# Altium project Car.PrjPcb
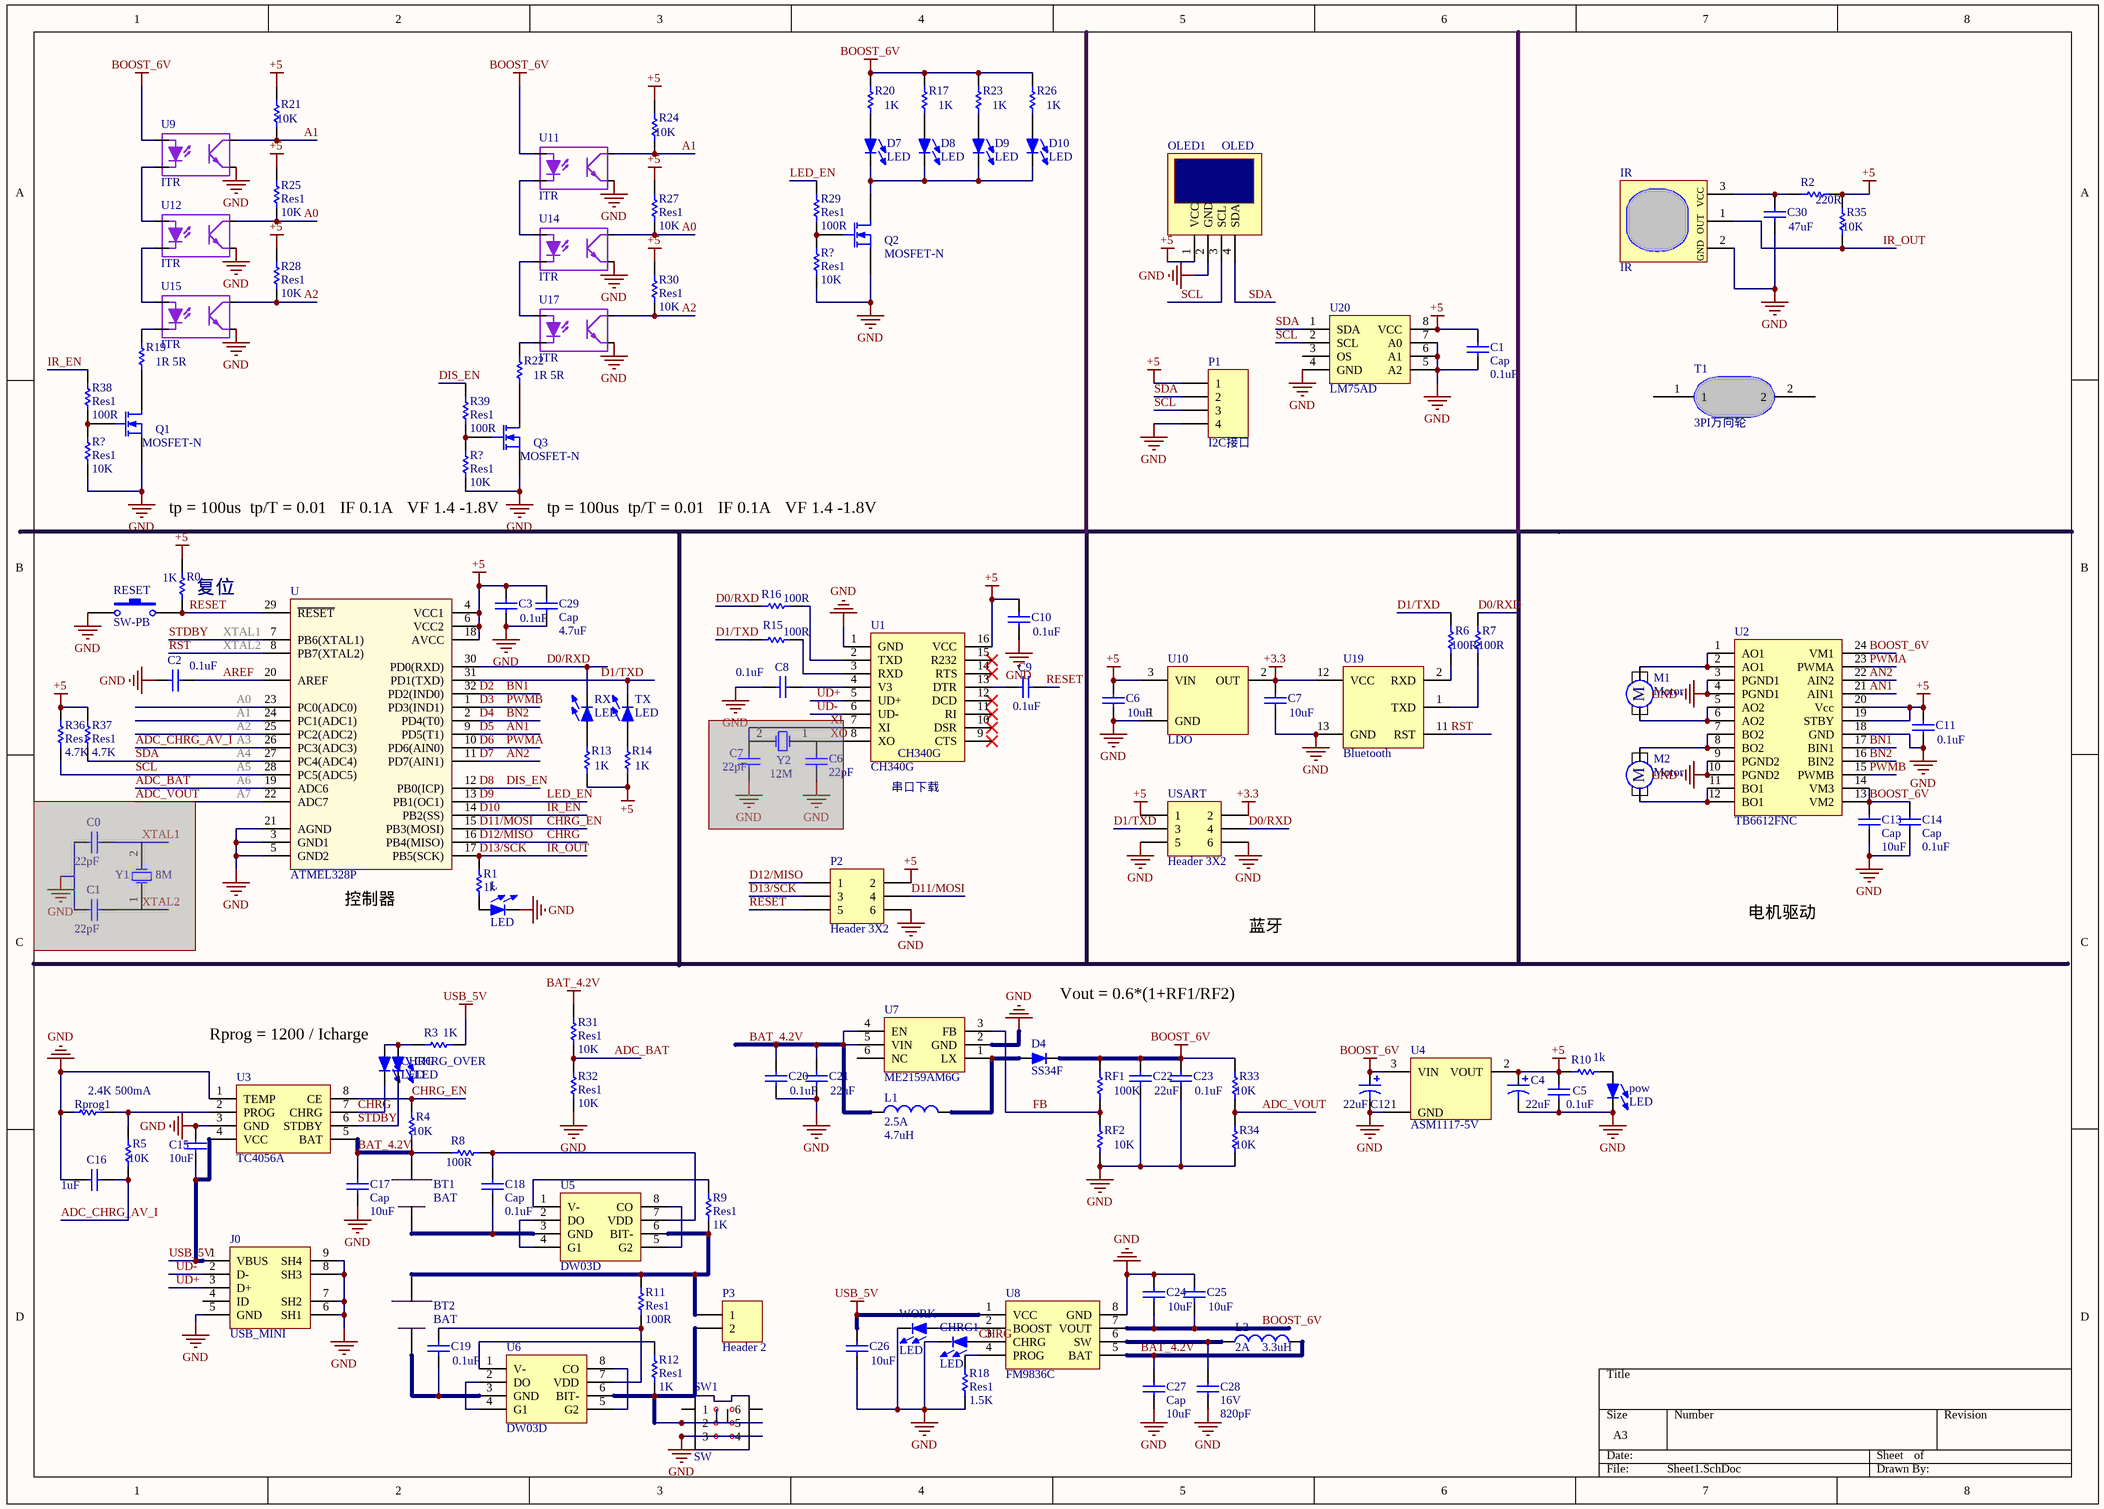
[diagram p0: Sheet1.SchDoc]
1 sheet, 132 parts. Net scope: global (net labels, ports and power ports of the same name join across sheets).
Board file: PCB1.PcbDoc

## Sheet Sheet1.SchDoc
size A3

### Parts
(Parts that share a designator on the sheet are numbered #1, #2 ... from top to bottom, then left to right.)
BT1  BAT  [电池盒_一节]
BT2  BAT  [电池盒_一节]
C0  value 22pF  [6-0805_N]  (hidden comment: Cap)  (masked out: inside a compile mask, not in the netlist)
C1#1  Cap  value 0.1uF  [6-0805_N]
C1#2  value 22pF  [6-0805_N]  (hidden comment: Cap)  (masked out: inside a compile mask, not in the netlist)
C2  value 0.1uF  [6-0805_N]  (hidden comment: Cap)
C3  value 0.1uF  [6-0805_N]  (hidden comment: Cap)
C4  value 22uF  [6-0805_N]  (hidden comment: Cap Pol3)
C5  value 0.1uF  [6-0805_N]  (hidden comment: Cap)
C6#1  value 10uF  [6-0805_N]  (hidden comment: Cap)
C6#2  value 22pF  [6-0805_N]  (hidden comment: Cap)  (masked out: inside a compile mask, not in the netlist)
C7#1  value 10uF  [6-0805_N]  (hidden comment: Cap)
C7#2  value 22pF  [6-0805_N]  (hidden comment: Cap)  (masked out: inside a compile mask, not in the netlist)
C8  value 0.1uF  [6-0805_N]  (hidden comment: Cap)
C9  value 0.1uF  [6-0805_N]  (hidden comment: Cap)
C10  value 0.1uF  [6-0805_N]  (hidden comment: Cap)
C11  value 0.1uF  [6-0805_N]  (hidden comment: Cap)
C12  value 22uF  [6-0805_N]  (hidden comment: Cap Pol3)
C13  Cap  value 10uF  [6-0805_N]
C14  Cap  value 0.1uF  [6-0805_N]
C15  value 10uF  [6-0805_N]  (hidden comment: Cap)
C16  value 1uF  [6-0805_N]  (hidden comment: Cap)
C17  Cap  value 10uF  [6-0805_N]
C18  Cap  value 0.1uF  [6-0805_N]
C19  value 0.1uF  [6-0805_N]  (hidden comment: Cap)
C20  value 0.1uF  [6-0805_N]  (hidden comment: Cap)
C21  value 22uF  [6-0805_N]  (hidden comment: Cap)
C22  value 22uF  [6-0805_N]  (hidden comment: Cap)
C23  value 0.1uF  [6-0805_N]  (hidden comment: Cap)
C24  value 10uF  [6-0805_N]  (hidden comment: Cap)
C25  value 10uF  [6-0805_N]  (hidden comment: Cap)
C26  value 10uF  [6-0805_N]  (hidden comment: Cap)
C27  Cap  value 10uF  [6-0805_N]
C28  16V  value 820pF  [6-0805_N]
C29  Cap  value 4.7uF  [6-0805_N]
C30  value 47uF  [6-0805_N]  (hidden comment: Cap)
CHRG  LED  [LED_0805]
CHRG1  LED  [LED_0805]
CHRG_OVER  LED  [LED_0805]
D4  SS34F  [SS34F - DIOM3426X12N]
D7  LED  [LED_0805]
D8  LED  [LED_0805]
D9  LED  [LED_0805]
D10  LED  [LED_0805]
IR  IR  [HDR1X3]
J0  USB_MINI  [MICRO_USB]
L  LED  [LED_0805]
L1  2.5A  value 4.7uH  [IND_5020]
L2  2A  value 3.3uH  [IND_5020]
M1  Motor  [Motor1]
M2  Motor  [Motor1]
OLED1  OLED  [OLED]
P1  I2C接口  [HDR1X4]
P2  Header 3X2  [HDR2X3]
P3  Header 2  [HDR1X2]
pow  LED  [LED_0805]
Q1  MOSFET-N  [SOT-23]
Q2  MOSFET-N  [SOT-23]
Q3  MOSFET-N  [SOT-23]
R0  value 1K  [6-0805_N]  (hidden comment: Res1)
R1  value 1k  [6-0805_N]  (hidden comment: Res1)
R2  value 220R  [6-0805_N]  (hidden comment: Res1)
R3  value 1K  [6-0805_N]  (hidden comment: Res1)
R4  value 10K  [6-0805_N]  (hidden comment: Res1)
R5  value 10K  [6-0805_N]  (hidden comment: Res1)
R6  value 100R  [6-0805_N]  (hidden comment: Res1)
R7  value 100R  [6-0805_N]  (hidden comment: Res1)
R8  value 100R  [6-0805_N]  (hidden comment: Res1)
R9  Res1  value 1K  [6-0805_N]
R10  value 1k  [6-0805_N]  (hidden comment: Res1)
R11  Res1  value 100R  [6-0805_N]
R12  Res1  value 1K  [6-0805_N]
R13  value 1K  [6-0805_N]  (hidden comment: Res1)
R14  value 1K  [6-0805_N]  (hidden comment: Res1)
R15  value 100R  [6-0805_N]  (hidden comment: Res1)
R16  value 100R  [6-0805_N]  (hidden comment: Res1)
R17  value 1K  [6-0805_N]  (hidden comment: Res1)
R18  Res1  value 1.5K  [6-0805_N]
R19  value 1R 5R  [6-0805_N]  (hidden comment: Res1)
R20  value 1K  [6-0805_N]  (hidden comment: Res1)
R21  value 10K  [6-0805_N]  (hidden comment: Res1)
R22  value 1R 5R  [6-0805_N]  (hidden comment: Res1)
R23  value 1K  [6-0805_N]  (hidden comment: Res1)
R24  value 10K  [6-0805_N]  (hidden comment: Res1)
R25  Res1  value 10K  [6-0805_N]
R26  value 1K  [6-0805_N]  (hidden comment: Res1)
R27  Res1  value 10K  [6-0805_N]
R28  Res1  value 10K  [6-0805_N]
R29  Res1  value 100R  [6-0805_N]
R30  Res1  value 10K  [6-0805_N]
R31  Res1  value 10K  [6-0805_N]
R32  Res1  value 10K  [6-0805_N]
R33  value 10K  [6-0805_N]  (hidden comment: Res1)
R34  value 10K  [6-0805_N]  (hidden comment: Res1)
R35  value 10K  [6-0805_N]  (hidden comment: Res1)
R36  Res1  value 4.7K  [6-0805_N]
R37  Res1  value 4.7K  [6-0805_N]
R38  Res1  value 100R  [6-0805_N]
R39  Res1  value 100R  [6-0805_N]
R?#1  Res1  value 10K  [1608[0603]]
R?#2  Res1  value 10K  [1608[0603]]
R?#3  Res1  value 10K  [1608[0603]]
RESET  SW-PB  [KEY_SODFL_2-Leads]
RF1  value 100K  [6-0805_N]  (hidden comment: Res1)
RF2  value 10K  [6-0805_N]  (hidden comment: Res1)
Rprog1  500mA  value 2.4K  [6-0805_N]
RX  LED  [LED_0805]
SW1  SW  [KEY_ZS_5.8*5.8]
T1  3PI万向轮  [万向轮]
TX  LED  [LED_0805]
U  ATMEL328P  [TQFP 32]
U1  CH340G  [SOP16]
U2  TB6612FNC  [TB6612FNG]
U3  TC4056A  [TC4056A]
U4  ASM1117-5V  [SOT-223]
U5  DW03D  [TSOP8]
U6  DW03D  [TSOP8]
U7  ME2159AM6G  [SOT-23-6]
U8  FM9836C  [SOP8]
U9  ITR  [DIP4]
U10  LDO  [SOT-23-3L]
U11  ITR  [DIP4]
U12  ITR  [DIP4]
U14  ITR  [DIP4]
U15  ITR  [DIP4]
U17  ITR  [DIP4]
U19  Bluetooth  [HC-08]
U20  LM75AD  [SOP8 - noHotPad]
USART  Header 3X2  [HDR2X3 SMT]
WORK  LED  [LED_0805]
Y1  8M  [Crystal_Oscillator]  (masked out: inside a compile mask, not in the netlist)
Y2  12M  [Crystal_Oscillator]  (masked out: inside a compile mask, not in the netlist)

### Nets
+3.3: C7#1.2 U10.2(OUT) U19.12(VCC) USART.2
+5: C1#1.2 C3.2 C4.1 C5.2 C6#1.2 C10.2 C11.2 C29.2 OLED1.1(VCC) P1.1 P2.2 R0.2 R2.2 R10.2 R13.1 R14.1 R21.2 R24.2 R25.2 R27.2 R28.2 R30.2 R35.2 R36.2 R37.2 U.4(VCC1) U.6(VCC2) U.18(AVCC) U1.16(VCC) U2.19(STBY) U2.20(Vcc) U4.2(VOUT) U10.3(VIN) U20.8(VCC) USART.1
BAT_4.2V: BT1.1 C17.2 C20.2 C21.2 C27.2 L1.1 L2.2 R4.1 R8.1 R31.2 U3.5(BAT) U7.4(EN) U7.5(VIN) U8.5(BAT)
BOOST_6V: C12.1 C13.1 C14.2 C22.2 C23.2 C24.1 C25.1 D4.1 R17.2 R20.2 R23.2 R26.2 R33.2 RF1.2 U2.13(VM2) U2.14(VM3) U2.24(VM1) U4.3(VIN) U8.7(VOUT) U9.1 U11.1
GND: C1#1.1 C2.2 C3.1 C4.2 C5.1 C6#1.1 C7#1.1 C8.1 C10.1 C11.1 C12.2 C13.2 C14.1 C15.2 C16.1 C17.1 C20.1 C21.1 C22.1 C23.1 C24.2 C25.2 C26.1 C27.1 C28.1 C29.1 C30.1 CHRG1.2 IR.2(VCC) J0.5(GND) J0.6(SH1) J0.7(SH2) J0.8(SH3) J0.9(SH4) L.2 OLED1.2(GND) P1.4 P2.6 pow.2 Q1.3(S) Q2.3(S) Q3.3(S) R18.1 R32.1 R34.1 R?#1.1 R?#2.1 R?#3.1 RESET.1 RF2.1 Rprog1.1 SW1.3 SW1.4 U.3(GND1) U.5(GND2) U.21(AGND) U1.1(GND) U2.3(PGND1) U2.4(PGND1) U2.9(PGND2) U2.10(PGND2) U2.18(GND) U3.1(TEMP) U3.3(GND) U4.1(GND) U7.2(GND) U8.8(GND) U9.3 U10.1(GND) U11.3 U12.3 U14.3 U15.3 U17.3 U19.13(GND) U20.4(GND) U20.5(A2) U20.6(A1) U20.7(A0) USART.5 USART.6 WORK.2
USB_5V: C15.1 C26.2 J0.1(VBUS) R3.1 U3.4(VCC) U8.1(VCC)
A0: R25.1 R27.1 U.23(PC0(ADC0)) U12.4 U14.4
A1: R21.1 R24.1 U.24(PC1(ADC1)) U9.4 U11.4
A2: R28.1 R30.1 U.25(PC2(ADC2)) U15.4 U17.4
A3: C16.2 R5.1 U.26(PC3(ADC3))  [also labelled ADC_CHRG_AV_I]
A4: OLED1.4(SDA) P1.2 R37.1 U.27(PC4(ADC4)) U20.1(SDA)  [also labelled SDA]
A5: OLED1.3(SCL) P1.3 R36.1 U.28(PC5(ADC5)) U20.2(SCL)  [also labelled SCL]
A6: R31.1 R32.2 U.19(ADC6)  [also labelled ADC_BAT]
A7: U.22(ADC7)
ADC_VOUT: R33.1 R34.2
AN1: U.9(PD5(T1)) U2.21(AIN1)  [also labelled D5]
AN2: U.11(PD7(AIN1)) U2.22(AIN2)  [also labelled D7]
AREF: C2.1 U.20(AREF)
BN1: U.32(PD2(IND0)) U2.17(BIN1)  [also labelled D2]
BN2: U.2(PD4(T0)) U2.16(BIN2)  [also labelled D4]
CHRG: CHRG.2 CHRG1.1 P2.1 U.16(PB4(MISO)) U3.7(CHRG) U8.3(CHRG)  [also labelled D12/MISO]
CHRG_EN: P2.4 R4.2 U.15(PB3(MOSI)) U3.8(CE)  [also labelled D11/MOSI]
D0/RXD: R7.2 R16.1 RX.2 U.30(PD0(RXD)) USART.4
D1/TXD: R6.2 R15.1 TX.2 U.31(PD1(TXD)) USART.3
D3: U.1(PD3(IND1)) U2.15(PWMB)  [also labelled PWMB]
D6: U.10(PD6(AIN0)) U2.23(PWMA)  [also labelled PWMA]
D8: R39.2 U.12(PB0(ICP))  [also labelled DIS_EN]
D9: R29.2 U.13(PB1(OC1))  [also labelled LED_EN]
D10: R38.2 U.14(PB2(SS))  [also labelled IR_EN]
D13/SCK: IR.1(VCC) P2.3 R1.2 R35.1 U.17(PB5(SCK))  [also labelled IR_OUT]
FB: RF1.1 RF2.2 U7.3(FB)
RESET: C9.2 P2.5 R0.1 RESET.2 U.29(~{RESET})
RST: U.8(PB7(XTAL2)) U19.11(RST)  [also labelled XTAL2]
STDBY: CHRG_OVER.2 U.7(PB6(XTAL1)) U3.6(STDBY)  [also labelled XTAL1]
UD+: J0.3(D+) U1.5(UD+)
UD-: J0.2(D-) U1.6(UD-)
NetBT1_2: BT1.2 C18.1 U5.3(GND)
NetBT2_1: BT2.1 P3.1 R9.1 R11.2 U5.6(BIT-)
NetBT2_2: BT2.2 C19.1 U6.3(GND)
NetC8_2: C8.2 U1.4(V3)
NetC9_1: C9.1 U1.13(DTR)
NetC18_2: C18.2 R8.2 U5.7(VDD)
NetC19_2: C19.2 R11.1 U6.7(VDD)
NetC28_2: C28.2 L2.1 U8.6(SW)
NetC30_2: C30.2 IR.3(VCC) R2.1
NetCHRG_1: CHRG.1 CHRG_OVER.1 R3.2
NetD4_2: D4.2 L1.2 U7.1(LX)
NetD7_1: D7.1 R20.1
NetD7_2: D7.2 D8.2 D9.2 D10.2 Q2.1(D)
NetD8_1: D8.1 R17.1
NetD9_1: D9.1 R23.1
NetD10_1: D10.1 R26.1
NetL_1: L.1 R1.1
NetM1_1: M1.1 U2.5(AO2) U2.6(AO2)
NetM1_2: M1.2 U2.1(AO1) U2.2(AO1)
NetM2_1: M2.1 U2.11(BO1) U2.12(BO1)
NetM2_2: M2.2 U2.7(BO2) U2.8(BO2)
NetP3_2: P3.2 R12.1 SW1.2 SW1.5 U6.6(BIT-)
Netpow_1: pow.1 R10.1
NetQ1_1: Q1.1(D) R19.1
NetQ1_2: Q1.2(G) R38.1 R?#2.2
NetQ2_2: Q2.2(G) R29.1 R?#1.2
NetQ3_1: Q3.1(D) R22.1
NetQ3_2: Q3.2(G) R39.1 R?#3.2
NetR5_2: R5.2 Rprog1.2 U3.2(PROG)
NetR6_1: R6.1 U19.2(RXD)
NetR7_1: R7.1 U19.1(TXD)
NetR9_2: R9.2 U5.1(V-)
NetR12_2: R12.2 U6.1(V-)
NetR13_2: R13.2 RX.1
NetR14_2: R14.2 TX.1
NetR15_2: R15.2 U1.3(RXD)
NetR16_2: R16.2 U1.2(TXD)
NetR18_2: R18.2 U8.4(PROG)
NetR19_2: R19.2 U15.2
NetR22_2: R22.2 U17.2
NetU5_2: U5.2(DO) U5.4(G1)
NetU5_5: U5.5(G2) U5.8(CO)
NetU6_2: U6.2(DO) U6.4(G1)
NetU6_5: U6.5(G2) U6.8(CO)
NetU8_2: U8.2(BOOST) WORK.1
NetU9_2: U9.2 U12.1
NetU11_2: U11.2 U14.1
NetU12_2: U12.2 U15.1
NetU14_2: U14.2 U17.1

Not connected (* = marked no-connect by the designer): J0 4(ID); SW1 1 6; T1 1 2; U1 7(XI) 8(XO) 9(CTS)* 10(DSR)* 11(RI)* 12(DCD)* 14(RTS)* 15(R232)*; U7 6(NC); U20 3(OS)

### Notes on the sheet
- (near R?#3) tp = 100us  tp/T = 0.01   IF 0.1A   VF 1.4 -1.8V
- tp = 100us  tp/T = 0.01   IF 0.1A   VF 1.4 -1.8V
- (near R0) 复位
- (near U1) 串口下载
- (near U) 控制器
- 电机驱动
- 蓝牙
- Rprog = 1200 / Icharge
- Vout = 0.6*(1+RF1/RF2)
- (in symbol Motor) M
- (in symbol 红外一体化接收头) OUT; GND

### Library data of the parts
C0 C1#1 C1#2 C2 C3 C5 C6#1 C6#2 C7#1 C7#2 C8-C11 C13-C30 = Cap: Capacitor; Published: 8-Jun-2000; LatestRevisionDate: 17-Jul-2002; LatestRevisionNote: Re-released for DXP Platform.; PackageReference: RAD-0.3; Publisher: Altium Limited; PackageDescription: Radial Cap, Thru-Hole; 2 Leads; 0.3 in Pin Spacing
C4 C12 = Cap Pol3: Polarized Capacitor (Surface Mount); Published: 8-Jun-2000; LatestRevisionDate: 29-May-2009; LatestRevisionNote: IPC-7351 Footprint Added.; PackageReference: C0805; Publisher: Altium Limited; PackageDescription: Chip Capacitor
D4 = SS34F: Schottky Diode
IR = 红外一体化接收头
J0 = USB_MINI: usb
L1 L2 = Inductor: Code_IEC: 1005; Published: 8-Jun-2000; LatestRevisionDate: 29-May-2009; LatestRevisionNote: IPC-7351 Footprint Added.; PackageReference: 0402-A; Publisher: Altium Limited; PackageDescription: Chip Inductor; Code_JEITA: 0402
OLED1 = OLED: I2C OLED
P1 = Header 4: Header, 4-Pin; LatestRevisionDate: 17-Jul-2002; LatestRevisionNote: Re-released for DXP Platform.; Publisher: Altium Limited
P2 USART = Header 3X2: Header, 3-Pin, Dual row; LatestRevisionDate: 17-Jul-2002; LatestRevisionNote: Re-released for DXP Platform.; Publisher: Altium Limited
P3 = Header 2: Header, 2-Pin; LatestRevisionDate: 17-Jul-2002; LatestRevisionNote: Re-released for DXP Platform.; Publisher: Altium Limited
Q1-Q3 = MOSFET-N: N-Channel MOSFET; Published: 8-Jun-2000; LatestRevisionDate: 17-Jul-2002; LatestRevisionNote: Re-released for DXP Platform.; PackageVersion: 1995/1996; PackageReference: E3; Publisher: Altium Limited; PackageDescription: TO, Flat Index; 3 In-Line, Axial Leads; Body Dia. 4.6mm; Lead Dia. 0.5 mm (max)
R0-R39 R?#1-R?#3 RF1 RF2 Rprog1 = Res1: Resistor; Published: 8-Jun-2000; LatestRevisionDate: 17-Jul-2002; LatestRevisionNote: Re-released for DXP Platform.; PackageReference: AXIAL-0.3; Publisher: Altium Limited; PackageDescription: Axial Device, Thru-Hole; 2 Leads; 0.3 in Pin Spacing
RESET = SW-PB: Switch; Published: 24-Mar-1999; LatestRevisionDate: 17-Jul-2002; LatestRevisionNote: Re-released for DXP Platform.; PackageReference: SPST-2; Publisher: Altium Limited; PackageDescription: Switch; 2 Leads
SW1 = SW: 自锁开关
U = ATMEL-328P
U3 = TC4056A: 1A线性充电芯片
U4 = ASM1117-5V: ASM117
U5 U6 = DW03D: 锂电池保护芯片
U7 = ME2159AM6G: 锂电池升压芯片
U9 U11 U12 U14 U15 U17 = ITR20001/T
U10 = ME6209: 3.3V LDO
U19 = Bluetooth: 蓝牙模块
U20 = LM75AD: 温度传感器
Y1 Y2 = XTAL: Crystal Oscillator; Published: 8-Jun-2000; LatestRevisionDate: 17-Jul-2002; LatestRevisionNote: Re-released for DXP Platform.; PackageReference: R38; Publisher: Altium Limited; PackageDescription: Crystal, Thru-Hole; 2 Leads; Body 3.1 x 8.2 mm (Dia.xH)